# Altium schematic sheet CH32F205RBT6-R0.SchDoc
size 304 x 198 mm
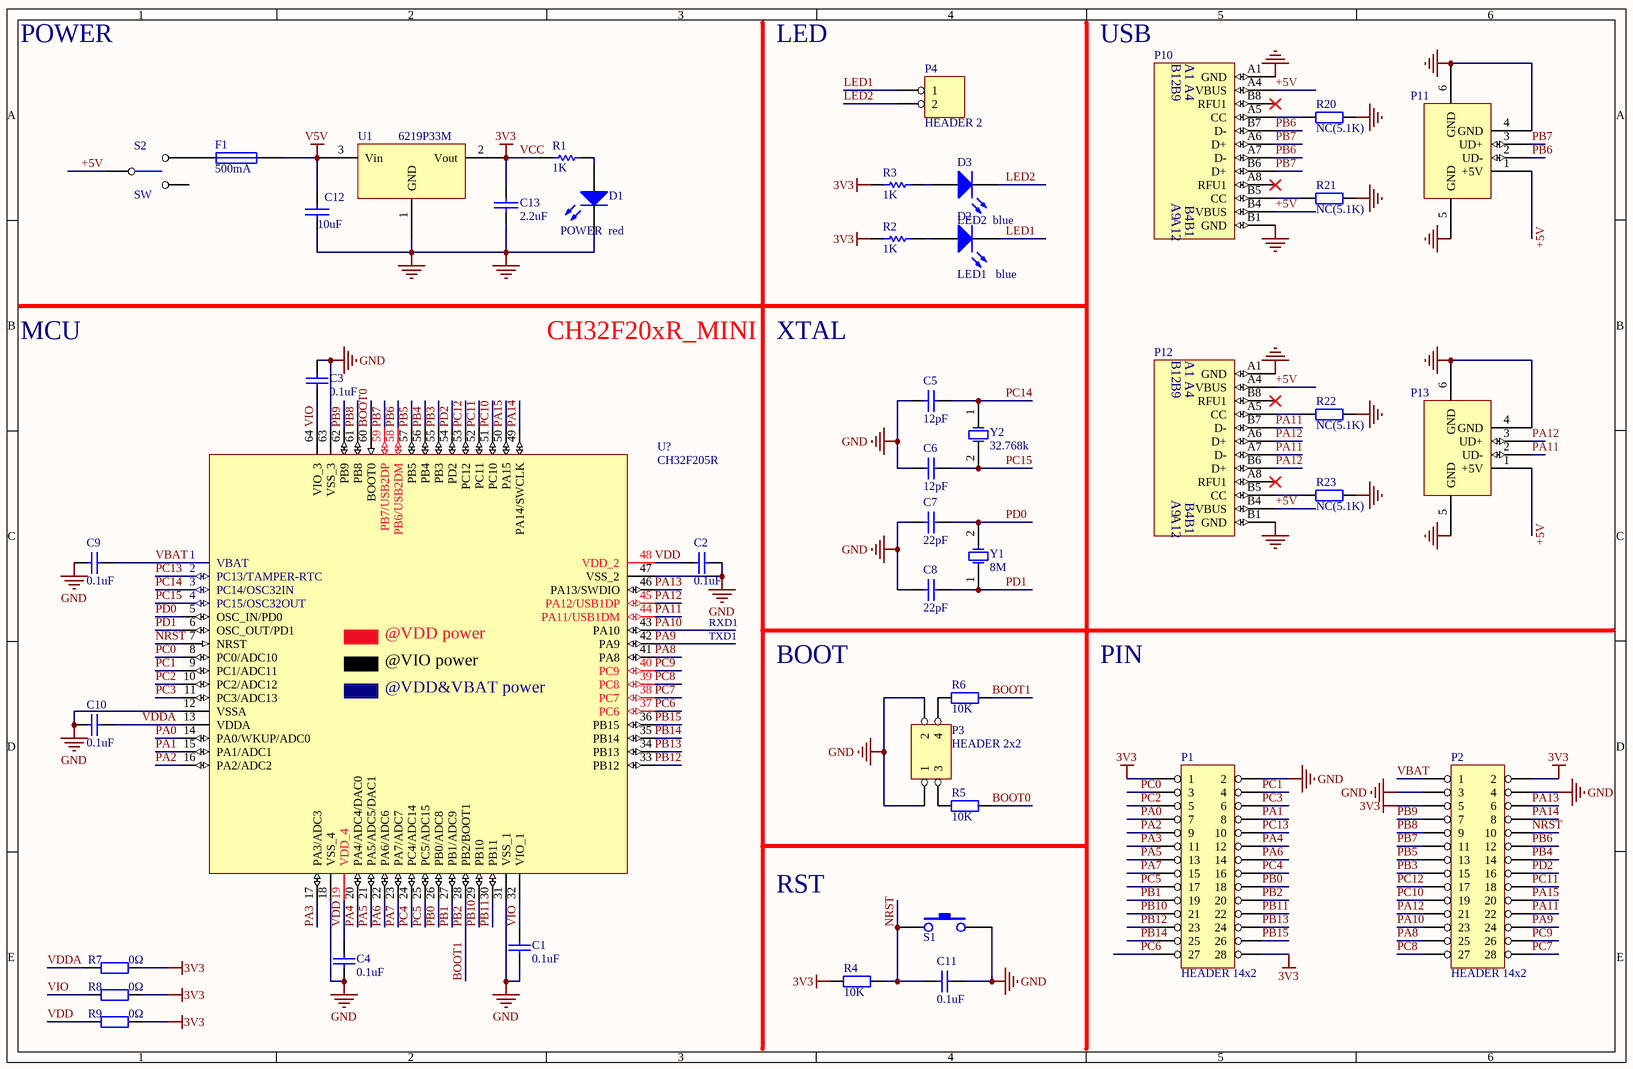
[diagram p0: CH32F205RBT6-R0.SchDoc]

## Parts
C1  0.1uF  [0603_C]
C2  0.1uF  [0603_C]
C3  0.1uF  [0603_C]
C4  0.1uF  [0603_C]
C5  12pF  [0603_C]
C6  12pF  [0603_C]
C7  22pF  [0603_C]
C8  22pF  [0603_C]
C9  0.1uF  [0603_C]
C10  0.1uF  [0603_C]
C11  0.1uF  [0603_C]
C12  10uF  [3216_C]
C13  2.2uF  [0603_C]
D1  POWER  red  [0603+]
D2  LED1   blue  [0603+]
D3  LED2  blue  [0603+]
F1  500mA  [0603]
P1  HEADER 14x2  [IDC28-2.54MM]
P2  HEADER 14x2  [IDC28-2.54MM]
P3  HEADER 2x2  [IDC4-2.54MM]
P4  HEADER 2  [SIP2-2.54mm]
P10  TYPE-C  [TYPE-C-Receptacle-2.0]  (value not drawn)
P11  USB_A  [USBAF]  (value not drawn)
P12  TYPE-C  [TYPE-C-Receptacle-2.0]  (value not drawn)
P13  USB_A  [USBAF]  (value not drawn)
R1  1K  [0603]
R2  1K  [0603]
R3  1K  [0603]
R4  10K  [0603]
R5  10K  [0603]
R6  10K  [0603]
R7  0Ω  [0603]
R8  0Ω  [0603]
R9  0Ω  [0603]
R20  NC(5.1K)  [0603]
R21  NC(5.1K)  [0603]
R22  NC(5.1K)  [0603]
R23  NC(5.1K)  [0603]
S1  RST  [SMD_6.1x3.65x2.5mm-KEY]  (value not drawn)
S2  SW  [KEY2]
U1  6219P33M  [SOT-23]
U?  CH32F205R  [LQFP64M_10x10]
Y1  8M  [XT_AT49]
Y2  32.768k  [FC-135]

## Nets
GND: C1.1 C2.1 C3.1 C4.1 C5.2 C6.2 C7.1 C8.1 C9.2 C10.2 C11.1 C12.2 C13.2 D1.2(K) P1.2 P2.3 P2.4 P3.1 P3.2 P10.A1(GND) P10.B1(GND) P11.4(GND) P11.5(GND) P11.6(GND) P12.A1(GND) P12.B1(GND) P13.4(GND) P13.5(GND) P13.6(GND) R20.2 R21.2 R22.2 R23.2 S1.2 U1.1(GND) U?.12(VSSA) U?.18(VSS_4) U?.31(VSS_1) U?.47(VSS_2) U?.63(VSS_3)
V5V: C12.1 F1.2 U1.3(Vin)
VCC: C13.1 P1.1 P1.28 P2.2 P2.5 R1.2 R2.1 R3.1 R4.2 R7.1 R8.1 R9.1 U1.2(Vout)  [also labelled 3V3]
+5V: P10.A4(VBUS) P10.B4(VBUS) P11.1(+5V) P12.A4(VBUS) P12.B4(VBUS) P13.1(+5V) S2.1
BOOT0: R5.1 U?.60(BOOT0)
BOOT1: P1.20 R6.1 U?.28(PB2/BOOT1)  [also labelled PB2]
LED1: D2.2(K) P4.1
LED2: D3.2(K) P4.2
NRST: C11.2 P2.10 R4.1 S1.1 U?.7(NRST)
PA0: P1.7 U?.14(PA0/WKUP/ADC0)
PA1: P1.8 U?.15(PA1/ADC1)
PA2: P1.9 U?.16(PA2/ADC2)
PA3: P1.11 U?.17(PA3/ADC3)
PA4: P1.12 U?.20(PA4/ADC4/DAC0)
PA5: P1.13 U?.21(PA5/ADC5/DAC1)
PA6: P1.14 U?.22(PA6/ADC6)
PA7: P1.15 U?.23(PA7/ADC7)
PA8: P2.25 U?.41(PA8)
PA9: P2.24 U?.42(PA9)
PA10: P2.23 U?.43(PA10)
PA11: P2.22 P12.A7(D-) P12.B7(D-) P13.2(UD-) U?.44(PA11/USB1DM)
PA12: P2.21 P12.A6(D+) P12.B6(D+) P13.3(UD+) U?.45(PA12/USB1DP)
PA13: P2.6 U?.46(PA13/SWDIO)
PA14: P2.8 U?.49(PA14/SWCLK)
PA15: P2.20 U?.50(PA15)
PB0: P1.18 U?.26(PB0/ADC8)
PB1: P1.19 U?.27(PB1/ADC9)
PB3: P2.15 U?.55(PB3)
PB4: P2.14 U?.56(PB4)
PB5: P2.13 U?.57(PB5)
PB6: P2.12 P10.A7(D-) P10.B7(D-) P11.2(UD-) U?.58(PB6/USB2DM)
PB7: P2.11 P10.A6(D+) P10.B6(D+) P11.3(UD+) U?.59(PB7/USB2DP)
PB8: P2.9 U?.61(PB8)
PB9: P2.7 U?.62(PB9)
PB10: P1.21 U?.29(PB10)
PB11: P1.22 U?.30(PB11)
PB12: P1.23 U?.33(PB12)
PB13: P1.24 U?.34(PB13)
PB14: P1.25 U?.35(PB14)
PB15: P1.26 U?.36(PB15)
PC0: P1.3 U?.8(PC0/ADC10)
PC1: P1.4 U?.9(PC1/ADC11)
PC2: P1.5 U?.10(PC2/ADC12)
PC3: P1.6 U?.11(PC3/ADC13)
PC4: P1.16 U?.24(PC4/ADC14)
PC5: P1.17 U?.25(PC5/ADC15)
PC6: P1.27 U?.37(PC6)
PC7: P2.28 U?.38(PC7)
PC8: P2.27 U?.39(PC8)
PC9: P2.26 U?.40(PC9)
PC10: P2.19 U?.51(PC10)
PC11: P2.18 U?.52(PC11)
PC12: P2.17 U?.53(PC12)
PC13: P1.10 U?.2(PC13/TAMPER-RTC)
PC14: C5.1 U?.3(PC14/OSC32IN) Y2.1(OSC1)
PC15: C6.1 U?.4(PC15/OSC32OUT) Y2.2(OSC2)
PD0: C7.2 U?.5(OSC_IN/PD0) Y1.2(OSC2)
PD1: C8.2 U?.6(OSC_OUT/PD1) Y1.1(OSC1)
PD2: P2.16 U?.54(PD2)
VBAT: C9.1 P2.1 U?.1(VBAT)
VDD: C2.2 C4.2 R9.2 U?.19(VDD_4) U?.48(VDD_2)
VDDA: C10.1 R7.2 U?.13(VDDA)
VIO: C1.2 C3.2 R8.2 U?.32(VIO_1) U?.64(VIO_3)
NetD1_1: D1.1(A) R1.1
NetD2_1: D2.1(A) R2.2
NetD3_1: D3.1(A) R3.2
NetF1_1: F1.1 S2.3
NetP3_3: P3.3 R5.2
NetP3_4: P3.4 R6.2
NetP10_A5: P10.A5(CC) R20.1
NetP10_B5: P10.B5(CC) R21.1
NetP12_A5: P12.A5(CC) R22.1
NetP12_B5: P12.B5(CC) R23.1

Not connected (* = marked no-connect by the designer): P10 A8(RFU1)* B8(RFU1)*; P12 A8(RFU1)* B8(RFU1)*; S2 2

## Notes on the sheet
- POWER
- LED
- USB
- MCU
- CH32F20xR_MINI
- XTAL
- TXD1
- RXD1
- BOOT
- PIN
- RST
- Title
- Size:
- Date:
- A3
- Number:
- Time:
- Revision:
- Sheet
- of
- File:
- (in symbol CH32F205R) @VDD power; @VIO power; @VDD&VBAT power
- (in symbol TYPE-C1) B12; B9; A9; A12

## Library data of the parts
C1-C11 = Cap: Capacitor; Published: 8-Jun-2000; LatestRevisionDate: 17-Jul-2002; LatestRevisionNote: Re-released for DXP Platform.; PackageReference: RAD-0.3; Publisher: Altium Limited
  C11: Value: 0.1uF
C12 C13 = CAP: Capacitor
D1-D3 = LED0: Typical INFRARED GaAs LED; Published: 8-Jun-2000; LatestRevisionDate: 08-Jul-2005; LatestRevisionNote: Mech Layer 1 removed.; PackageReference: LED-0; Publisher: Altium Limited
F1 = FUSE1: Fuse
P1 P2 = HEADER 14x2: Header, 14-Pin, Dual row
P3 = HEADER 2x2: Header, 2-Pin, Dual row
P4 = HEADER 2: Header, 2-Pin
P10 P12 = TYPE-C1
P11 P13 = USB: USB Port
R1-R3 = Res Semi: Semiconductor Resistor; Published: 8-Jun-2000; LatestRevisionDate: 17-Jul-2002; LatestRevisionNote: Re-released for DXP Platform.; PackageReference: AXIAL-0.5; Publisher: Altium Limited; Value: 1K
R4-R9 R20-R23 = Res2: Resistor
  R4-R6: Published: 8-Jun-2000; LatestRevisionDate: 17-Jul-2002; LatestRevisionNote: Re-released for DXP Platform.; PackageReference: AXIAL-0.4; Publisher: Altium Limited; Value: 10K
  R7-R9: Published: 8-Jun-2000; LatestRevisionDate: 17-Jul-2002; LatestRevisionNote: Re-released for DXP Platform.; PackageReference: AXIAL-0.4; Publisher: Altium Limited
S1 = KEY
U? = CH32F205R: ARM M3 HD-MCU, 144MHz, USB_480M, USB OTG, 2*CAN, 4*OPA
Y1 Y2 = XTAL: Crystal Oscillator; Published: 8-Jun-2000; LatestRevisionDate: 17-Jul-2002; LatestRevisionNote: Re-released for DXP Platform.; PackageReference: R38; Publisher: Altium Limited